# Altium schematic sheet Mixer.SchDoc
size A3
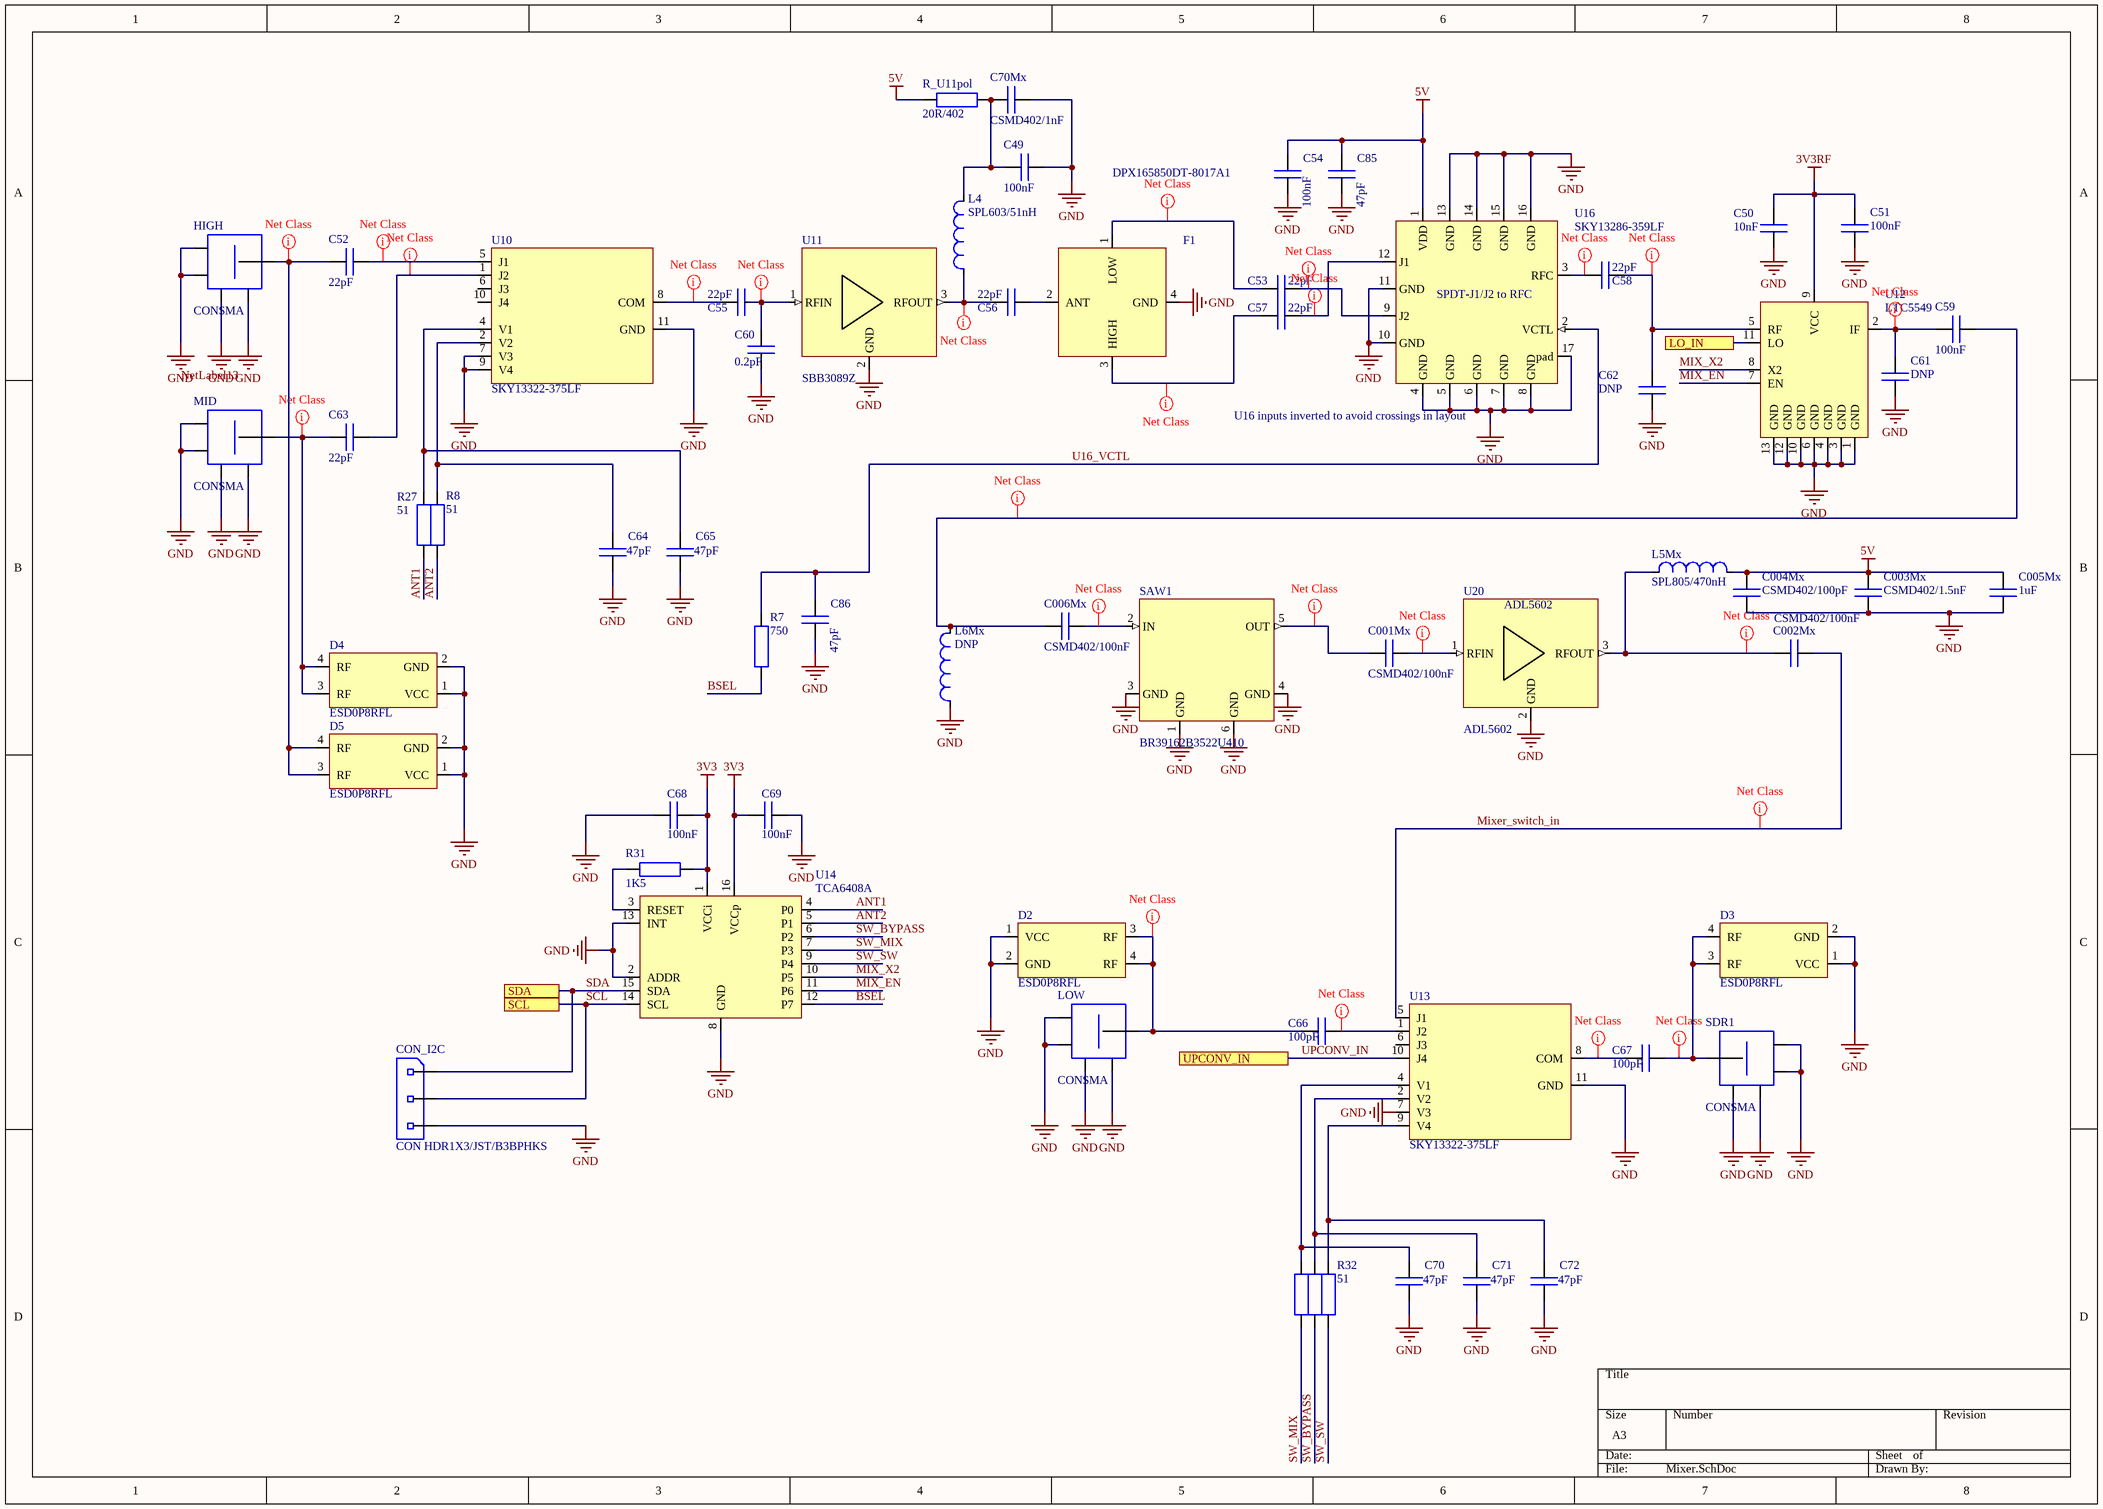
[diagram p0: Mixer.SchDoc]

## Parts
C001Mx  CSMD402/100nF  [smd C0402]
C002Mx  CSMD402/100nF  [smd C0402]
C003Mx  CSMD402/1.5nF  [smd C0402]
C004Mx  CSMD402/100pF  [smd C0402]
C005Mx  1uF  [smd C0603_0.80]
C006Mx  CSMD402/100nF  [smd C0402]
C49  100nF  [smd C0603_0.80]
C50  10nF  [smd C0402]
C51  100nF  [smd C0603_0.80]
C52  22pF  [smd C0402]
C53  22pF  [smd C0402]
C54  100nF  [smd C0603_0.80]
C55  22pF  [smd C0402]
C56  22pF  [smd C0402]
C57  22pF  [smd C0402]
C58  22pF  [smd C0402]
C59  100nF  [smd C0402]
C60  0.2pF  [smd C0402]
C61  DNP  [smd C0402]
C62  DNP  [smd C0402]
C63  22pF  [smd C0402]
C64  47pF  [smd C0603_0.80]
C65  47pF  [smd C0603_0.80]
C66  100pF  [smd C0402]
C67  100pF  [smd C0402]
C68  100nF  [smd C0603_0.80]
C69  100nF  [smd C0603_0.80]
C70  47pF  [smd C0603_0.80]
C70Mx  CSMD402/1nF  [smd C0402]
C71  47pF  [smd C0603_0.80]
C72  47pF  [smd C0603_0.80]
C85  47pF  [smd C0603_0.80]
C86  47pF  [smd C0603_0.80]
CON_I2C  CON HDR1X3/JST/B3BPHKS  [con HDR/BNR1x3 (pitch 2mm, JST B3B-PH-K-S)]
D2  ESD0P8RFL  [ESD0P8RFL]
D3  ESD0P8RFL  [ESD0P8RFL]
D4  ESD0P8RFL  [ESD0P8RFL]
D5  ESD0P8RFL  [ESD0P8RFL]
F1  DPX165850DT-8017A1  [DPX165850DT-8017A1]
HIGH  CONSMA  [con SMA (recht)]
L4  SPL603/51nH  [smd C0603]
L5Mx  SPL805/470nH  [smd C0805]
L6Mx  DNP  [smd C0603]
LOW  CONSMA  [con SMA (recht)]
MID  CONSMA  [con SMA (recht)]
R7  750  [smd C0603_0.45]
R8  51  [smd C0603_0.45]
R27  51  [smd C0603_0.45]
R28  51  [smd C0603_0.45]  (value not drawn)
R30  51  [smd C0603_0.45]  (value not drawn)
R31  1K5  [smd C0805_0.50]
R32  51  [smd C0603_0.45]
R_U11pol  20R/402  [smd C0402_0.35]
SAW1  BR39162B3522U410  [SAW_package]
SDR1  CONSMA  [con SMA (recht)]
U10  SKY13322-375LF  [QFN50P200X300X80-10N]
U11  SBB3089Z  [SB3089Z_footprint]
U12  LTC5549  [LTC5549]
U13  SKY13322-375LF  [QFN50P200X300X80-10N]
U14  TCA6408A  [TSOP65P640X100-16M]
U16  SKY13286-359LF  [QFN-16_skyworks]
U20  ADL5602  [LFCSP]

## Ports
LO_IN, SCL, SDA, UPCONV_IN

## Nets
3V3: C68.2 C69.1 R31.1 U14.1(VCCi) U14.16(VCCp)
3V3RF: C50.2 C51.2 U12.9(VCC)
5V: C003Mx.1 C004Mx.1 C005Mx.2 C54.2 C85.2 L5Mx.2 R_U11pol.1 U16.1(VDD)
GND: C003Mx.2 C004Mx.2 C005Mx.1 C49.1 C50.1 C51.1 C54.1 C60.1 C61.1 C62.1 C64.1 C65.1 C68.1 C69.2 C70.1 C70Mx.2 C71.1 C72.1 C85.1 C86.1 CON_I2C.3 D2.1(VCC) D2.2(GND) D3.1(VCC) D3.2(GND) D4.1(VCC) D4.2(GND) D5.1(VCC) D5.2(GND) F1.4(GND) HIGH.2 HIGH.3 HIGH.4 HIGH.5 L6Mx.1 LOW.2 LOW.3 LOW.4 LOW.5 MID.2 MID.3 MID.4 MID.5 SAW1.1(GND) SAW1.3(GND) SAW1.4(GND) SAW1.6(GND) SDR1.2 SDR1.3 SDR1.4 SDR1.5 U10.7(V3) U10.9(V4) U10.11(GND) U11.2(GND) U12.1(GND) U12.3(GND) U12.4(GND) U12.6(GND) U12.10(GND) U12.12(GND) U12.13(GND) U13.7(V3) U13.11(GND) U14.2(ADDR) U14.8(GND) U14.13(INT) U16.4(GND) U16.5(GND) U16.6(GND) U16.7(GND) U16.8(GND) U16.10(GND) U16.11(GND) U16.13(GND) U16.14(GND) U16.15(GND) U16.16(GND) U16.17(pad) U20.2(GND)
ANT1: R27.2 U14.4(P0)
ANT2: R8.1 U14.5(P1)
BSEL: R7.1 U14.12(P7)
LO_IN: U12.11(LO) ; port LO_IN
MIX_EN: U12.7(EN) U14.11(P6)
MIX_X2: U12.8(X2) U14.10(P5)
Mixer_switch_in: C002Mx.2 U13.5(J1)
SCL: CON_I2C.2 U14.14(SCL) ; port SCL
SDA: CON_I2C.1 U14.15(SDA) ; port SDA
SW_BYPASS: R30.1 U14.6(P2)
SW_MIX: R28.1 U14.7(P3)
SW_SW: R32.1 U14.9(P4)
U16_VCTL: C86.2 R7.2 U16.2(VCTL)
UPCONV_IN: U13.10(J4) ; port UPCONV_IN
NetC001Mx_1: C001Mx.1 SAW1.5(OUT)
NetC001Mx_2: C001Mx.2 U20.1(RFIN)
NetC002Mx_1: C002Mx.1 L5Mx.1 U20.3(RFOUT)
NetC006Mx_1: C006Mx.1 C59.2 L6Mx.2
NetC006Mx_2: C006Mx.2 SAW1.2(IN)
NetC49_2: C49.2 C70Mx.1 L4.2 R_U11pol.2
NetC52_1: C52.1 U10.5(J1)
NetC52_2: C52.2 D5.3(RF) D5.4(RF) HIGH.1
NetC53_1: C53.1 F1.1(LOW)
NetC53_2: C53.2 U16.9(J2)
NetC55_1: C55.1 U10.8(COM)
NetC55_2: C55.2 C60.2 U11.1(RFIN)
NetC56_1: C56.1 L4.1 U11.3(RFOUT)
NetC56_2: C56.2 F1.2(ANT)
NetC57_1: C57.1 F1.3(HIGH)
NetC57_2: C57.2 U16.12(J1)
NetC58_1: C58.1 U16.3(RFC)
NetC58_2: C58.2 C62.2 U12.5(RF)
NetC59_1: C59.1 C61.2 U12.2(IF)
NetC63_1: C63.1 U10.1(J2)
NetC63_2: C63.2 D4.3(RF) D4.4(RF) MID.1
NetC64_2: C64.2 R8.2 U10.2(V2)
NetC65_2: C65.2 R27.1 U10.4(V1)
NetC66_1: C66.1 D2.3(RF) D2.4(RF) LOW.1
NetC66_2: C66.2 U13.1(J2)
NetC67_1: C67.1 U13.8(COM)
NetC67_2: C67.2 D3.3(RF) D3.4(RF) SDR1.1
NetC70_2: C70.2 R28.2 U13.4(V1)
NetC71_2: C71.2 R30.2 U13.2(V2)
NetC72_2: C72.2 R32.2 U13.9(V4)
NetR31_2: R31.2 U14.3(RESET)

Not connected (* = marked no-connect by the designer): U10 6(J3) 10(J4); U13 6(J3)

## Layout directives
net class RF: Mixer_switch_in, NetC001Mx_1, NetC001Mx_2, NetC002Mx_1, NetC006Mx_1, NetC006Mx_2, NetC52_1, NetC52_2, NetC53_1, NetC53_2, NetC55_1, NetC55_2, NetC56_1, NetC57_1, NetC57_2, NetC58_1, NetC58_2, NetC59_1, NetC63_1, NetC63_2, NetC66_1, NetC66_2, NetC67_1, NetC67_2

## Notes on the sheet
- (near U16) U16 inputs inverted to avoid crossings in layout
- Labels drawn without touching a wire or pin: NetLabel13
- (in symbol SKY13286-359LF) SPDT-J1/J2 to RFC

## Library data of the parts
C001Mx C002Mx C006Mx C59 = CSMD402/100nF: smd capaciteit, verp.0402, 100nF; Part Number: CSMD402/100nF; Component Kind: Standard; Component Type: Standard; Pin Count: 2; Supplier 1: Farnell
  C001Mx C002Mx C006Mx: Designator: CSMD402/100nF
C003Mx = CSMD402/1.5nF: smd capaciteit, verp.0402, 1.5nF; Part Number: CSMD402/1.5nF; Component Kind: Standard; Component Type: Standard; Designator: CSMD402/1.5nF; Pin Count: 2; Supplier 1: Farnell
C004Mx = CSMD402/100pF: smd capaciteit, verp.0402, 100pF; Part Number: CSMD402/100pF; Component Kind: Standard; Component Type: Standard; Designator: CSMD402/100pF; Pin Count: 2; Supplier 1: Farnell
C005Mx = CSMD603/1uF: smd capaciteit, verp.0603, 1uF; Part Number: CSMD603/18nF; Component Kind: Standard; Component Type: Standard; Designator: CSMD603/18nF; Library Reference: CSMD603/18nF; Pin Count: 2; Supplier 1: Farnell
C49 C51 C54 C68 C69 = CSMD603/100nF: smd capaciteit, verp.0603, 100nF; Part Number: CSMD603/100nF; Component Kind: Standard; Component Type: Standard; Designator: CSMD603/100nF; Pin Count: 2
  C49 C51 C54: Supplier 1: Farnell
C50 = CSMD402/100nF: smd capaciteit, verp.0402, 10nF; Part Number: CSMD402/100nF; Component Kind: Standard; Component Type: Standard; Designator: CSMD402/100nF; Pin Count: 2; Supplier 1: Farnell
C52 C53 C55-C58 C60-C63 C66 C67 = CSMD402/22pF: smd capaciteit, verp.0402, 22pF; Part Number: CSMD402/22pF; Component Kind: Standard; Component Type: Standard; Designator: CSMD402/22pF; Pin Count: 2; Supplier 1: Farnell
C64 C65 C70-C72 C85 C86 = CSMD603/100pF: smd capaciteit, verp.0603, 100pF; Part Number: CSMD603/100pF; Component Kind: Standard; Component Type: Standard; Designator: CSMD603/100pF; Pin Count: 2; Supplier 1: Farnell
C70Mx = CSMD402/1nF: smd capaciteit, verp.0402, 1nF; Part Number: CSMD402/1nF; Component Kind: Standard; Component Type: Standard; Designator: CSMD402/1nF; Pin Count: 2; Supplier 1: Farnell
CON_I2C = CON HDR1X3/JST/B3BPHKS: header 1x3, JST B3B-PH-K-S; Part Number: CON HDR1X3/JST/B3BPHKS; Component Kind: Standard; Component Type: Standard; Designator: CON HDR1X3/JST/B3BPHKS; Pin Count: 3; Supplier 1: Farnell
HIGH LOW MID SDR1 = CON SMA: SMA connector, rechtop; Part Number: CON SMA; Component Kind: Standard; Component Type: Standard; Designator: CON SMA; Pin Count: 5; Supplier 1: Farnell
L5Mx = SPL805/470nH: smd spoel, verpakking 805, 470nH; Component Kind: Standard; Supplier 1: Farnell
L6Mx = SPL603/82nH: Manufacturer part number: 0603CS-82NXGLW; Component Kind: Standard; Supplier 1: Mouser; Supplier Part Number 1: 994-0603CS-82NXGLW; Series: https://www.coilcraft.com/0603cs.cfm
R7 R8 R27 R28 R30 R32 = 750R/603: weerstand SMD603, 750R; Supplier 1: Farnell
R31 = 1K8/805: weerstand SMD805, 1K8
R_U11pol = 20R/402: weerstand SMD402, 20R; Supplier 1: Farnell
SAW1 = BR39162B3522U410: Saw Filter; Manufacturer part number: B39162B3522U410; Manufacturer: TDK
U11 = SBB3089Z: RF Amplifier; Manufacturer: rfmd/Qorvo; MPN: SBB3089ZSR
U16 = SKY13286-359LF: SPDT-J2/J1 to RFC; Manufacturer: Skyworks
U20 = ADL5602: Gain block; Manufacturer part number: ADL5602ARKZ-R7; Manufacturer: Analog Devices
L4 = SPL603/51nH: Component Kind: Standard; Supplier 1: Farnell